# EAGLE design nixie-clock (EAGLE 9.2.2)
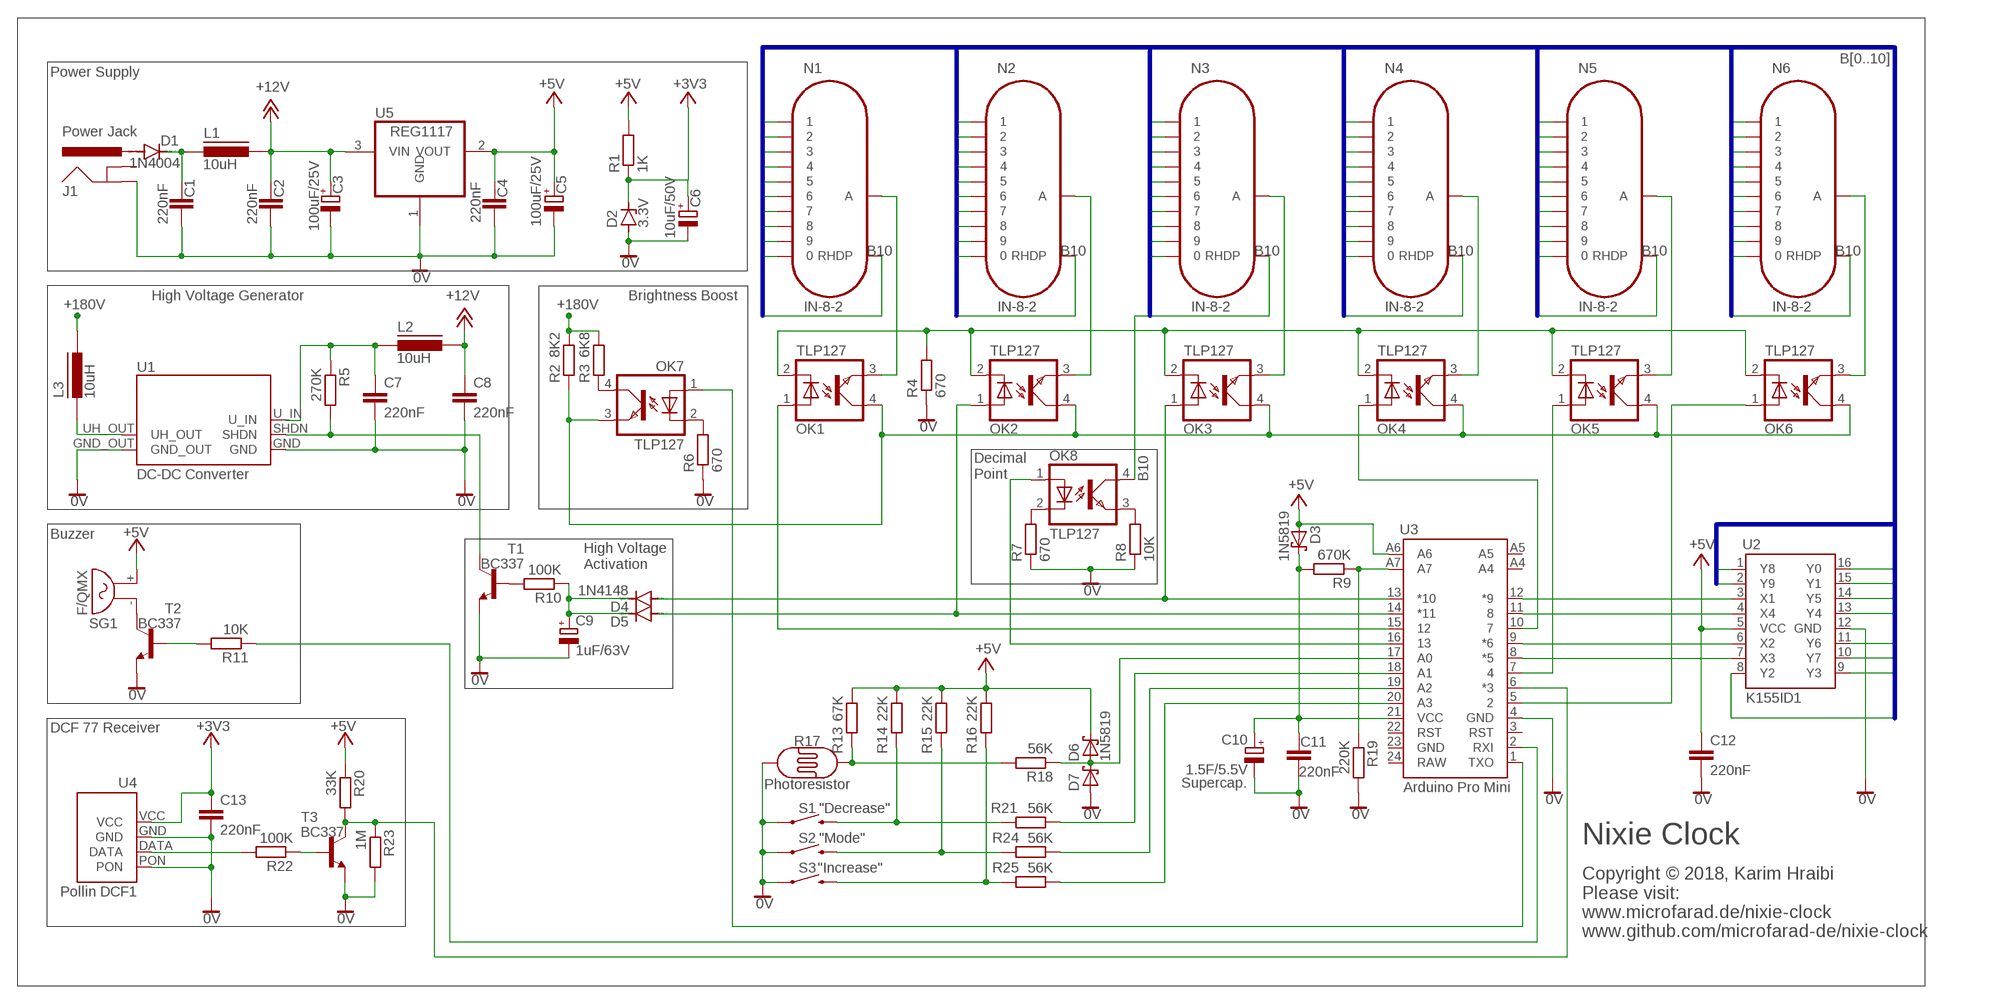
[diagram p0: schematic, sheet 1]

## Parts
C1  220nF  C-EU025-024X044  [C025-024X044]
C2  220nF  C-EU025-024X044  [C025-024X044]
C3  100uF/25V  CPOL-EUE2.5-6  [E2,5-6]
C4  220nF  C-EU025-024X044  [C025-024X044]
C5  100uF/25V  CPOL-EUE2.5-6  [E2,5-6]
C6  10uF/50V  CPOL-EUE2-4  [E2-4]
C7  220nF  C-EU025-024X044  [C025-024X044]
C8  220nF  C-EU025-024X044  [C025-024X044]
C9  1uF/63V  CPOL-EUE1.8-4  [E1,8-4]
C10  1.5F/5.5V  SUPERCAP/1.5F/5.5V  [SUPERCAP/1.5F/5.5V]
C11  220nF  C-EU025-024X044  [C025-024X044]
C12  220nF  C-EU025-024X044  [C025-024X044]
C13  220nF  C-EU025-024X044  [C025-024X044]
D1  1N4004  [DO41-10]
D2  3.3V  ZENER-DIODEZD-5  [ZDIO-5]
D3  1N5819  1N5819-B  [DO41-7.6]
D4  1N4148  1N4148DO35-7  [DO35-7]
D5  1N4148  1N4148DO35-7  [DO35-7]
D6  1N5819  1N5819-B  [DO41-7.6]
D7  1N5819  1N5819-B  [DO41-7.6]
J1  Power Jack  POWER_JACKSLT  [POWER_JACK_SLOT]
L1  10uH  CHOKE/9.5MM  [CHOKE/9.5MM]
L2  10uH  CHOKE/9.5MM  [CHOKE/9.5MM]
L3  10uH  CHOKE/9.5MM  [CHOKE/9.5MM]
N1  IN-8-2  [IN-8-2]
N2  IN-8-2  [IN-8-2]
N3  IN-8-2  [IN-8-2]
N4  IN-8-2  [IN-8-2]
N5  IN-8-2  [IN-8-2]
N6  IN-8-2  [IN-8-2]
OK1  TLP127  [MINI-FLAT-4]
OK2  TLP127  [MINI-FLAT-4]
OK3  TLP127  [MINI-FLAT-4]
OK4  TLP127  [MINI-FLAT-4]
OK5  TLP127  [MINI-FLAT-4]
OK6  TLP127  [MINI-FLAT-4]
OK7  TLP127  [MINI-FLAT-4]
OK8  TLP127  [MINI-FLAT-4]
R1  1K  R-EU_0207/7  [0207/7]
R2  8K2  R-EU_0207/7  [0207/7]
R3  6K8  R-EU_0207/7  [0207/7]
R4  670  R-EU_0207/7  [0207/7]
R5  270K  R-EU_0207/7  [0207/7]
R6  670  R-EU_0207/7  [0207/7]
R7  670  R-EU_0207/7  [0207/7]
R8  10K  R-EU_0207/7  [0207/7]
R9  670K  R-EU_0207/7  [0207/7]
R10  100K  R-EU_0207/7  [0207/7]
R11  10K  R-EU_0207/7  [0207/7]
R13  67K  R-EU_0207/7  [0207/7]
R14  22K  R-EU_0207/7  [0207/7]
R15  22K  R-EU_0207/7  [0207/7]
R16  22K  R-EU_0207/7  [0207/7]
R17  Photoresistor  PHOTOCELLPTH  [PHOTOCELL]
R18  56K  R-EU_0207/7  [0207/7]
R19  220K  R-EU_0207/7  [0207/7]
R20  33K  R-EU_0207/7  [0207/7]
R21  56K  R-EU_0207/7  [0207/7]
R22  100K  R-EU_0207/7  [0207/7]
R23  1M  R-EU_0207/7  [0207/7]
R24  56K  R-EU_0207/7  [0207/7]
R25  56K  R-EU_0207/7  [0207/7]
S1  "Decrease"  MOMENTARY-SWITCH-SPST-PTH-6.0MM  [TACTILE_SWITCH_PTH_6.0MM]
S2  "Mode"  MOMENTARY-SWITCH-SPST-PTH-6.0MM  [TACTILE_SWITCH_PTH_6.0MM]
S3  "Increase"  MOMENTARY-SWITCH-SPST-PTH-6.0MM  [TACTILE_SWITCH_PTH_6.0MM]
SG1  F/QMX  [F/QMX]
T1  BC337  [TO92]
T2  BC337  [TO92]
T3  BC337  [TO92]
U1  DC-DC Converter  CHINA_HV_DC_DC  [CHINA_HV_DC_DC]
U2  K155ID1  [DIL16]
U3  Arduino Pro Mini  ARDUINO_PRO_MINI_TS  [ARDUINO_PRO_MINI_TS]
U4  Pollin DCF1  DCF1  [DCF1]
U5  REG1117  [SOT223]

## Nets
0V: C1.2 C2.2 C3.- C4.2 C5.- C6.- C7.2 C8.2 C9.- C10.- C11.2 C12.2 C13.2 D2.A D7.A J1.GND@2(GND) R4.1 R6.1 R7.1 R8.1 R17.1 R19.2 R23.2 S1.1 S2.1 S3.1 T1.1(E) T2.1(E) T3.1(E) U1.GND U1.GND_OUT U2.12(GND) U3.4(GND) U4.GND U4.PON U5.1(GND)
180VRAW: L3.1 U1.UH_OUT
+3V3: C6.+ C13.1 D2.C R1.1 U4.VCC
+5V: C4.1 C5.+ C12.1 D3.A D6.C R1.2 R13.1 R14.1 R15.1 R16.1 R20.1 SG1.+ U2.5(VCC) U3.A6 U5.2(VOUT)
+12V: C2.1 C3.+ C8.1 L1.2 L2.2 U5.3(VIN)
+180V: L3.2 R2.2 R3.2
B0: N1.0 N2.0 N3.0 N4.0 N5.0 N6.0 U2.16(Y0)
B1: N1.1 N2.1 N3.1 N4.1 N5.1 N6.1 U2.15(Y1)
B2: N1.2 N2.2 N3.2 N4.2 N5.2 N6.2 U2.8(Y2)
B3: N1.3 N2.3 N3.3 N4.3 N5.3 N6.3 U2.9(Y3)
B4: N1.4 N2.4 N3.4 N4.4 N5.4 N6.4 U2.13(Y4)
B5: N1.5 N2.5 N3.5 N4.5 N5.5 N6.5 U2.14(Y5)
B6: N1.6 N2.6 N3.6 N4.6 N5.6 N6.6 U2.11(Y6)
B7: N1.7 N2.7 N3.7 N4.7 N5.7 N6.7 U2.10(Y7)
B8: N1.8 N2.8 N3.8 N4.8 N5.8 N6.8 U2.1(Y8)
B9: N1.9 N2.9 N3.9 N4.9 N5.9 N6.9 U2.2(Y9)
B10: N1..(RHDP) N2..(RHDP) N3..(RHDP) N4..(RHDP) N5..(RHDP) N6..(RHDP) OK8.4(COL)
N$1: N6.A OK6.3(EMIT)
N$2: N5.A OK5.3(EMIT)
N$3: N4.A OK4.3(EMIT)
N$4: N3.A OK3.3(EMIT)
N$5: N2.A OK2.3(EMIT)
N$6: N1.A OK1.3(EMIT)
N$7: OK1.4(COL) OK2.4(COL) OK3.4(COL) OK4.4(COL) OK5.4(COL) OK6.4(COL) OK7.3(EMIT) R2.1
N$8: OK7.4(COL) R3.1
N$9: OK6.1(A) U3.5
N$10: OK5.1(A) U3.7
N$11: OK4.1(A) U3.10
N$12: D4.A OK3.1(A) U3.13(*10)
N$13: D5.A OK2.1(A) U3.14(*11)
N$14: OK1.1(A) U3.15
N$15: C7.1 L2.1 R5.1 U1.U_IN
N$16: R10.2 T1.2(B)
N$17: C9.+ D4.C D5.C R10.1
N$18: R5.2 T1.3(C) U1.SHDN
N$19: OK1.2(C) OK2.2(C) OK3.2(C) OK4.2(C) OK5.2(C) OK6.2(C) R4.2
N$20: OK7.2(C) R6.2
N$21: OK7.1(A) U3.1(TXO)
N$22: OK8.3(EMIT) R8.2
N$23: OK8.2(C) R7.2
N$24: OK8.1(A) U3.16
N$25: D1.A J1.PWR
N$26: C1.1 D1.C L1.1
N$27: R20.2 R23.1 T3.3(C) U3.6(*3)
N$28: R11.2 T2.2(B)
N$29: R22.1 T3.2(B)
N$30: R22.2 U4.DATA
N$31: SG1.- T2.3(C)
N$32: R11.1 U3.2(RXI)
N$33: C10.+ C11.1 D3.C R9.2 U3.21(VCC)
N$34: R9.1 R19.1 U3.A7
N$35: D6.A D7.C R18.1 U3.17(A0)
N$36: R13.2 R17.2 R18.2
N$37: R14.2 R21.2 S1.3
N$38: R15.2 R24.2 S2.3
N$39: R16.2 R25.2 S3.3
N$40: R21.1 U3.18(A1)
N$41: R24.1 U3.19(A2)
N$42: R25.1 U3.20(A3)
X1: U2.3(X1) U3.12(*9)
X2: U2.6(X2) U3.9(*6)
X3: U2.7(X3) U3.8(*5)
X4: U2.4(X4) U3.11
Unconnected: J1.GND@1(GNDBREAK) U3.3(RST) U3.22(RST) U3.A4 U3.A5

## Buses
B[0..10]

## Notes on the sheet
- Power Supply
- High Voltage Generator | Brightness Boost
- Decimal
  Point
- Buzzer
- High Voltage
  Activation
- DCF 77 Receiver
- Supercap.
- Nixie Clock
- Copyright © 2018, Karim Hraibi
  Please visit:
  www.microfarad.de/nixie-clock
  www.github.com/microfarad-de/nixie-clock

## Power pins joined to a net without a drawn wire
GND: U3.23(GND)
RAW: U3.24(RAW)

## Library data of the parts
C1 C2 C4 C7 C8 C11-C13 = rcl:C-EU: CAPACITOR, European symbol; SPICEPREFIX: C
C3 C5 C6 C9 = rcl:CPOL-EU: POLARIZED CAPACITOR, European symbol; SPICEPREFIX: C
C10 = karim:SUPERCAP/1.5F/5.5V: Super-Capacitor Ratings: 5.5F 1.5v
D1 = diode:1N4004: DIODE general purpose rectifier, 1 A
D2 = diode:ZENER-DIODE: Z-Diode
D3 D6 D7 = diode:1N581*: 1.0A SCHOTTKY BARRIER RECTIFIER Source: http://www.diodes.com/datasheets/ds23001.pdf
D4 D5 = diode:1N4148: DIODE high speed (Philips)
J1 = SparkFun-Connectors:POWER_JACK: Power Jack Connector This is the standard 5.5mm barrel jack for power. The PTH is the most common, proven, reliable, footprint. The Slot footprint only works if the mill layer is transmitted to the PCB fab house so be warned. Here are the connectors we sell at SparkFun: DC Barrel Power Jack/Connector <https://www.sparkfun.com/products/119> (PRT-00119) DC Barrel Power Jack/Connector (SMD) <https://www.sparkfun.com/products/12748> (PRT-12748) DC Barrel Jack Adapter - Breadboard Compatible <https://www.sparkfun.com/products/10811> (PRT-10811) It is used on this SparkFun product (and many, many others): SparkFun RedBoard - Programmed with Arduino <https://www.sparkfun.com/products/12757> (DEV-12757) Also, if you need a mating power supply or connector, please check these out: Wall Adapter Power Supply - 9VDC 650mA <https://www.sparkfun.com/products/298> (TOL-00298) DC Barrel Jack Adapter - Male <https://www.sparkfun.com/products/10287> (PRT-10287); PROD_ID: PRT-00119
L1-L3 = microfarad-de:CHOKE/9.5MM: Choke Self-Wound around a 9.5mm ferrite bead.
N1-N6 = russian-nixies:IN-8-2: IN-8-2: medium numeric frontview nixie tube
OK1-OK8 = karim:TLP127: TOSHIBA PHOTOCOUPLER GaAs IRED & PHOTO-TRANSISTOR Source: http://www.semicon.toshiba.co.jp/td/en/Opto/Photocoupler/en_20050928_TLP283_datasheet.pdf; OC_FARNELL: unknown; OC_NEWARK: unknown
R1-R11 R13-R16 R18-R25 = rcl:R-EU_: RESISTOR, European symbol; SPICEPREFIX: R
R17 = SparkFun-Sensors:PHOTOCELL: Photocell (Photodetector, Photo Resistor, CdS) This is a very small light sensor. A photocell changes (also called a photodetector, photo resistor, CdS or photoconductive cell) resistance depending on the amount of light it is exposed to. These little sensors make great ambient light triggers (when light in the room turns on, do something). Datasheet <http://cdn.sparkfun.com/datasheets/Sensors/LightImaging/SEN-09088.pdf> SparkFun Products Mini Photocell <https://www.sparkfun.com/products/9088> (SEN-09088); PROD_ID: COMP-09129; SF_ID: SEN-09088
S1-S3 = SparkFun-Switches:MOMENTARY-SWITCH-SPST: Momentary Switch (Pushbutton) - SPST Normally-open (NO) SPST momentary switches (buttons, pushbuttons). Variants PTH-12MM - 12mm square, through-hole Momentary Pushbutton Switch - 12mm Square <https://www.sparkfun.com/products/9190> (COM-09190) PTH-6.0MM, PTH-6.0MM-KIT - 6.0mm square, through-hole Mini Pushbutton Switch <https://www.sparkfun.com/products/97> (COM-00097) KIT package intended for soldering kit's - only one side of pads' copper is exposed. PTH-RIGHT-ANGLE-KIT - Right-angle, through-hole Right Angle Tactile Button <https://www.sparkfun.com/products/10791> - Used on SparkFun BigTime Watch Kit <https://www.sparkfun.com/products/11734> SMD-12MM - 12mm square, surface-mount Tactile Button - SMD (12mm) <https://www.sparkfun.com/products/12993> (COM-12993) Used on SparkFun PicoBoard <https://www.sparkfun.com/products/11888> SMD-4.5MM - 4.5mm Square Trackball Switch Used on SparkFun Blackberry Trackballer Breakout <https://www.sparkfun.com/products/13169> SMD-4.6MMX2.8MM - 4.60mm x 2.80mm, surface mount Used on SparkFun SAMD21 Mini Breakout <https://www.sparkfun.com/products/13664> SMD-5.2MM, SMD-5.2-REDUNDANT - 5.2mm square, surface-mount Mini Pushbutton Switch - SMD <https://www.sparkfun.com/products/8720> (COM-08720) Used on Arduino Pro Mini <https://www.sparkfun.com/products/11114> REDUNDANT package connects both switch circuits together SMD-6.0X3.5MM - 6.0 x 3.5mm, surface mount Momentary Reset Switch SMD <https://www.sparkfun.com/products/8229> (COM-08229) SMD-6.2MM-TALL - 6.2mm square, surface mount Tactile Button - SMD (6mm) <https://www.sparkfun.com/products/12992> Used on SparkFun Digital Sandbox <https://www.sparkfun.com/products/12651> SMD-RIGHT-ANGLE - Right-angle, surface mount Used on SparkFun Block for Intel® Edison - Arduino <https://www.sparkfun.com/products/13036>; PROD_ID: SWCH-08441; SF_SKU: COM-00097
SG1 = buzzer:F/QMX: BUZZER Source: Buerklin; OC_FARNELL: unknown; OC_NEWARK: unknown
T1-T3 = transistor:BC337: NPN TRANSISTOR
U1 = karim:CHINA_HV_DC_DC: High-Voltage DC-DC Converter From no-name Chinese manufacturer. Specifications: Designation: "WAGO 250-3.5" Input voltage: 12v - 24v Output voltage: 85v - 235v
U2 = karim:K155ID1: K155ID1 A BCD-to-decimal decoder designed to drive gas-filled Nixie tubes
U3 = karim:ARDUINO_PRO_MINI: Arduino Pro Mini Arduino Pro Mini compatible devices. Variants: Original "The Simple" clone (TS)
U4 = karim:DCF1: Pollin DCF1 DCF77 time signal receiver. Specifications Power supply: 1.2v - 3.3v Current: <90uA - 100uA
U5 = burr-brown:REG1117: 800mA and 1A Low Dropout (LDO) Positive Regulator 1.8V, 2.5V, 2.85V, 3.3V, 5V, and Adj; MPN: REG1117; OC_FARNELL: 1097566; OC_NEWARK: 14P6981

## Board
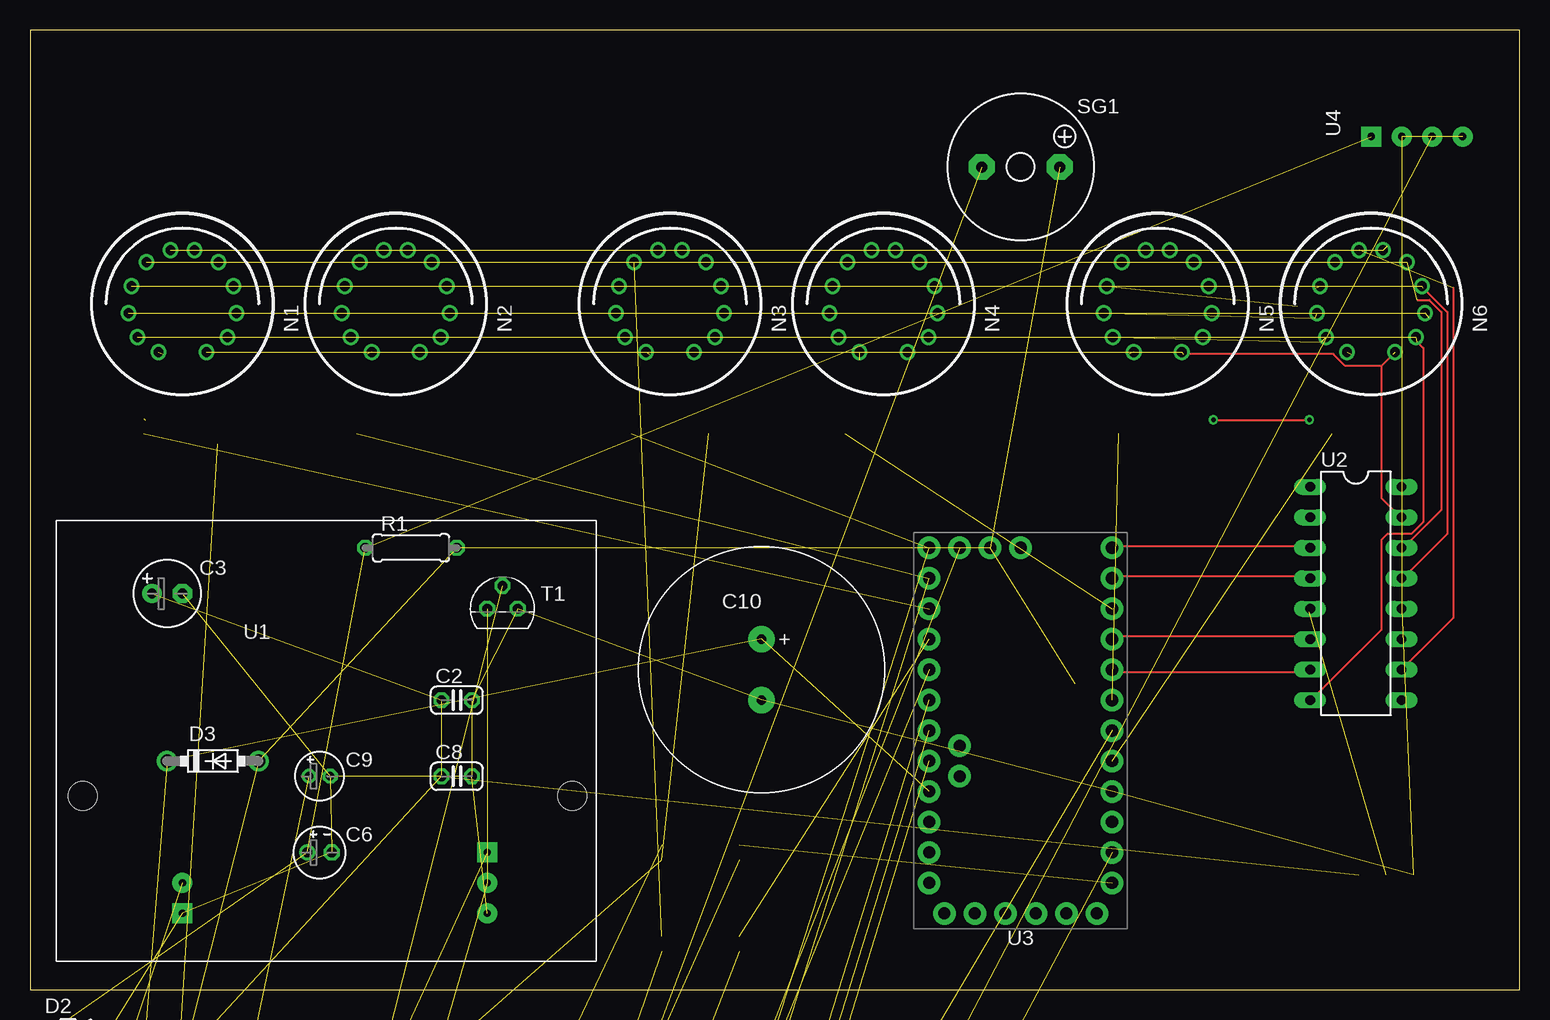
[diagram p1: board, top side]
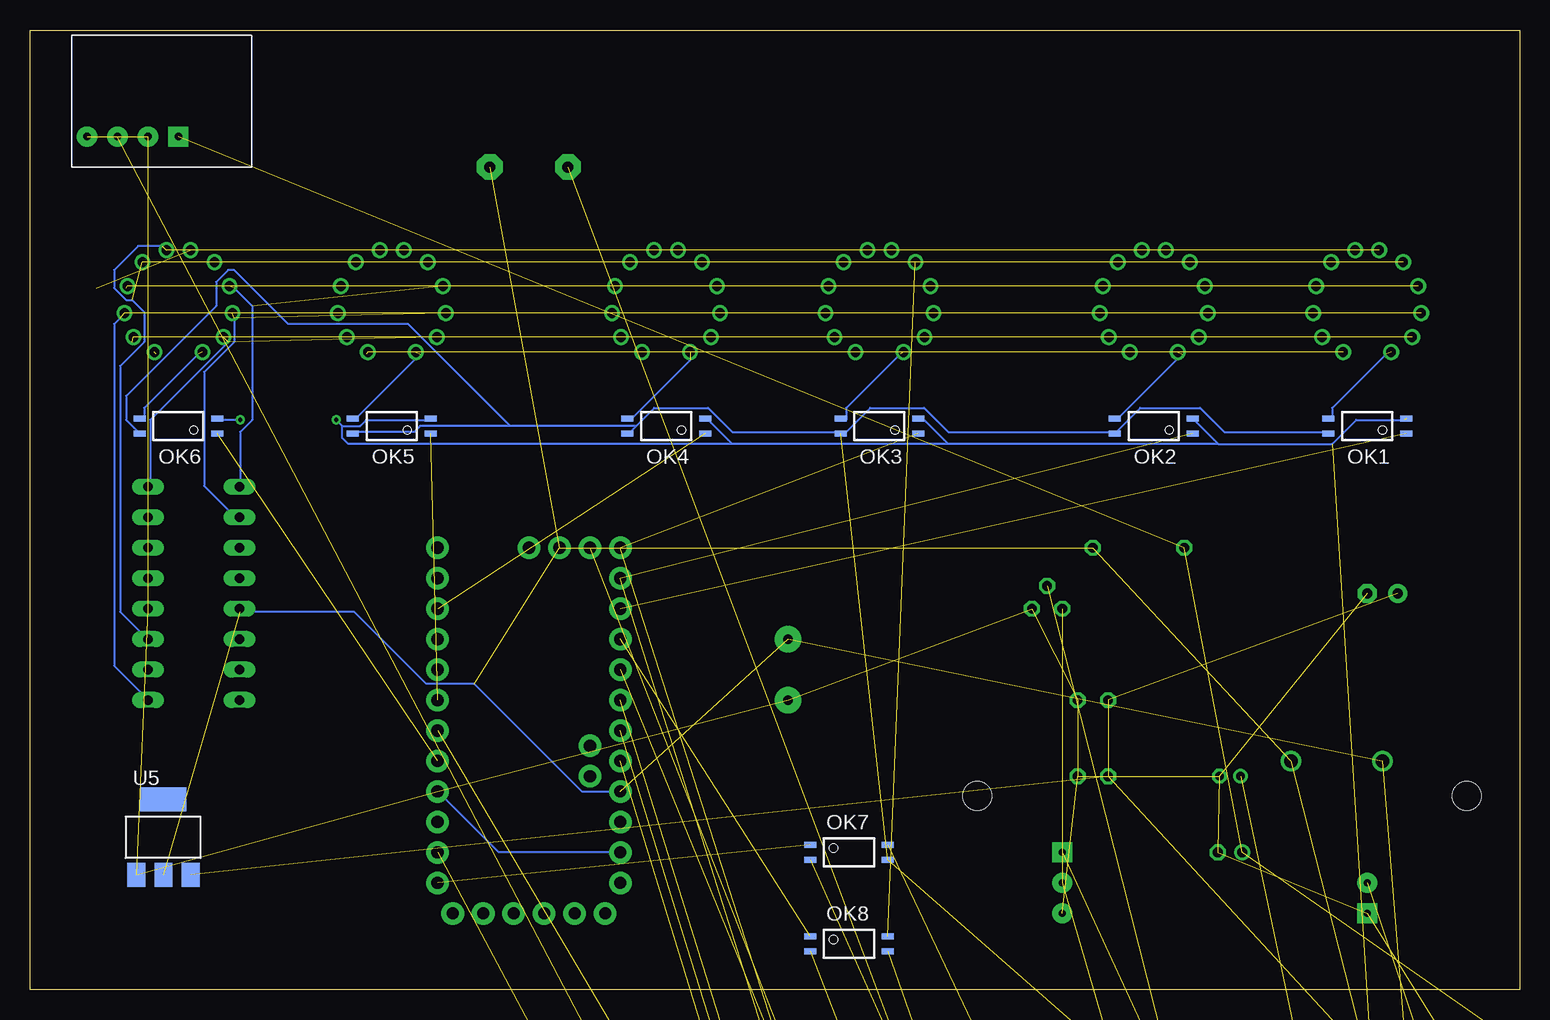
[diagram p2: board, bottom side, seen from below]

Size 124.13 x 80 mm. Coordinates in mm from the lower left corner, seen from the top.
Outline: 0,0 124.13,0 124.13,80 0,80 0,0
Copper layers (1*16): Top 0.035mm / dielectric 1.5mm / Bottom 0.035mm
Design rules "default": minimum track width 6mil, minimum drill 0.35mm, track to track 6mil, track to pad 6mil, pad to pad 6mil, via to via 6mil, smd to smd 6mil, copper to edge 40mil, drill to drill 6mil, minimum pad ring 10mil, minimum via ring 8mil, stop-mask expansion 4mil, vias tented up to drill 0mil, thermal gap 10mil

### Footprints (pad centres in the part's own frame; a part is rotated, then mirrored left to right if it is on the bottom)
C025-024X044 = drill 0.813 octagon: 1 -1.27,0; 2 1.27,0
E2,5-6 = drill 0.813 pad 1.6: + -1.27,0 | drill 0.813 pad 1.6 octagon: - 1.27,0
E2-4 = drill 0.813 pad 1.27: + -1.016,0 | drill 0.813 pad 1.27 octagon: - 1.016,0
E1,8-4 = drill 0.711 pad 1.168: + -0.889,0 | drill 0.711 pad 1.168 octagon: - 0.889,0
SUPERCAP/1.5F/5.5V = drill 0.8 pad 2.184: + 0,2.54; - 0,-2.54
DO41-10 = drill 1.118: A 5.08,0; C -5.08,0
ZDIO-5 = drill 0.813 octagon: A 2.54,0; C -2.54,0
DO41-7.6 = drill 1.1 pad 1.7: A 3.81,0; C -3.81,0
DO35-7 = drill 0.813 long: A 3.81,0; C -3.81,0
POWER_JACK_SLOT = drill 1 pad 2 long: GND@1 2.58,7.5; GND@2 7.58,10.8; PWR 2.58,13.8
CHOKE/9.5MM = drill 0.6 pad 1.676: 1 -5.08,0; 2 -1.27,0
IN-8-2 = drill 0.8: 0 -3.75,-2.75; 1 2,-4; 2 3.75,-2.75; 3 4.5,-0.75; 4 4.25,1.5; 5 3,3.5; 6 1,4.5; 7 -1,4.5; 8 -4.25,1.5; 9 -4.5,-0.75; . -3,3.5; A -2,-4
MINI-FLAT-4 = smd 1 x 0.5: 1 -3.24,0.635; 2 -3.24,-0.635; 3 3.24,-0.635; 4 3.24,0.635
0207/7 = drill 0.813 octagon: 1 -3.81,0; 2 3.81,0
PHOTOCELL = drill 0.8 pad 1.676: 1 -2,0; 2 2,0
TACTILE_SWITCH_PTH_6.0MM = drill 1.016 pad 1.88: 1 -3.251,2.261; 2 3.251,2.261; 3 -3.251,-2.261; 4 3.251,-2.261
F/QMX = drill 0.914 pad 2.159 octagon: + 3.251,0; - -3.251,0
TO92 = drill 0.813 octagon: 1 1.27,0; 2 0,1.905; 3 -1.27,0
CHINA_HV_DC_DC = drill 0.6 pad 1.676: GND 13.97,-12.7; SHDN 13.97,-10.16; UH_OUT -11.43,-10.16 | drill 0.6 pad 1.676 square: GND_OUT -11.43,-12.7; U_IN 13.97,-7.62 | hole 2.4: 21.07,-2.9; -19.73,-2.9
DIL16 = drill 0.813 long: 1 -3.81,8.89; 2 -3.81,6.35; 3 -3.81,3.81; 4 -3.81,1.27; 5 -3.81,-1.27; 6 -3.81,-3.81; 7 -3.81,-6.35; 8 -3.81,-8.89; 9 3.81,-8.89; 10 3.81,-6.35; 11 3.81,-3.81; 12 3.81,-1.27; 13 3.81,1.27; 14 3.81,3.81; 15 3.81,6.35; 16 3.81,8.89
ARDUINO_PRO_MINI_TS = drill 1.016 pad 1.88: 1 -7.62,12.7; 2 -7.62,10.16; 3 -7.62,7.62; 4 -7.62,5.08; 5 -7.62,2.54; 6 -7.62,0; 7 -7.62,-2.54; 8 -7.62,-5.08; 9 -7.62,-7.62; 10 -7.62,-10.16; 11 -7.62,-12.7; 12 -7.62,-15.24; 13 7.62,-15.24; 14 7.62,-12.7; 15 7.62,-10.16; 16 7.62,-7.62; 17 7.62,-5.08; 18 7.62,-2.54; 19 7.62,0; 20 7.62,2.54; 21 7.62,5.08; 22 7.62,7.62; 23 7.62,10.16; 24 7.62,12.7; A4 5.08,1.27; A5 5.08,3.81; A6 2.54,-15.24; A7 5.08,-15.24; BLK 6.35,15.24; DTR -6.35,15.24; GND 3.81,15.24; GND2 0,-15.24; RXI -1.27,15.24; TXO -3.81,15.24; VCC 1.27,15.24
DCF1 = drill 0.6 pad 1.676: DATA -2.54,-2.54; GND -2.54,0; PON -2.54,-5.08 | drill 0.6 pad 1.676 square: VCC -2.54,2.54
SOT223 = smd 1.499 x 2.007: 1 -2.261,-3.15; 2 0.025,-3.15; 3 2.311,-3.15 | smd 3.81 x 2.007: 4 0,3.15

### Placement (x,y rotation side)
C1  -20.32,-262.89 0 top  (outside the outline)
C2  35.56,24.13 0 top
C3  11.43,33.02 0 top
C4  2.54,-53.34 0 top  (outside the outline)
C5  3.81,-45.72 0 top  (outside the outline)
C6  24.13,11.43 0 top
C7  -20.32,-270.51 0 top  (outside the outline)
C8  35.56,17.78 0 top
C9  24.13,17.78 0 top
C10  60.96,26.67 0 top
C11  2.54,-106.68 0 top  (outside the outline)
C12  2.54,-114.3 0 top  (outside the outline)
C13  -8.89,-139.7 0 top  (outside the outline)
D1  -5.08,-132.08 0 top  (outside the outline)
D2  3.81,-3.81 0 top  (outside the outline)
D3  15.24,19.05 0 top
D4  -17.78,-241.3 0 top  (outside the outline)
D5  -17.78,-247.65 0 top  (outside the outline)
D6  -17.78,-278.13 0 top  (outside the outline)
D7  -17.78,-300.99 0 top  (outside the outline)
J1  -10.16,-127 0 top  (outside the outline)
L1  6.35,-13.97 0 top  (outside the outline)
L2  6.35,-68.58 0 top  (outside the outline)
L3  6.35,-25.4 0 top  (outside the outline)
N1  12.7,57.15 0 top
N2  30.48,57.15 0 top
N3  53.34,57.15 0 top
N4  71.12,57.15 0 top
N5  93.98,57.15 0 top
N6  111.76,57.15 0 top
OK1  12.7,46.99 180 bottom
OK2  30.48,46.99 180 bottom
OK3  53.34,46.99 180 bottom
OK4  71.12,46.99 180 bottom
OK5  93.98,46.99 180 bottom
OK6  111.76,46.99 180 bottom
OK7  55.88,11.43 0 bottom
OK8  55.88,3.81 0 bottom
R1  31.75,36.83 0 top
R2  5.08,-34.29 0 top  (outside the outline)
R3  6K7  [0207/7]  5.08,-96.52 0 top  (outside the outline)
R4  5.08,-60.96 0 top  (outside the outline)
R5  5.08,-91.44 0 top  (outside the outline)
R6  5.08,-101.6 0 top  (outside the outline)
R7  5.08,-127 0 top  (outside the outline)
R8  5.08,-121.92 0 top  (outside the outline)
R9  -6.35,-186.69 0 top  (outside the outline)
R10  5.08,-86.36 0 top  (outside the outline)
R11  -6.35,-176.53 0 top  (outside the outline)
R13  -17.78,-220.98 0 top  (outside the outline)
R14  -17.78,-226.06 0 top  (outside the outline)
R15  -17.78,-231.14 0 top  (outside the outline)
R16  -17.78,-236.22 0 top  (outside the outline)
R17  -20.32,-198.12 0 top  (outside the outline)
R18  -6.35,-181.61 0 top  (outside the outline)
R19  -6.35,-191.77 0 top  (outside the outline)
R20  -6.35,-151.13 0 top  (outside the outline)
R21  -17.78,-285.75 0 top  (outside the outline)
R22  -6.35,-156.21 0 top  (outside the outline)
R23  -6.35,-161.29 0 top  (outside the outline)
R24  -17.78,-290.83 0 top  (outside the outline)
R25  -17.78,-295.91 0 top  (outside the outline)
S1  -12.7,-198.12 0 top  (outside the outline)
S2  -19.05,-205.74 0 top  (outside the outline)
S3  -19.05,-213.36 0 top  (outside the outline)
SG1  82.55,68.58 0 top
T1  39.37,31.75 0 top
T2  -7.62,-166.37 0 top  (outside the outline)
T3  -7.62,-146.05 0 top  (outside the outline)
U1  24.13,19.05 0 top
U2  110.49,33.02 0 top
U3  82.55,21.59 180 top
U4  114.3,73.66 90 top
U5  113.03,12.7 0 bottom

### Tracks (layer width: path | path; a pad name or v marks a point on that pad's centre or on a via)
0V  (35 unrouted)
180VRAW  (1 unrouted)
+3V3  (4 unrouted)
+5V  (14 unrouted)
  Bottom 0.152: 75.12,16.5 78.12,16.5 87.12,25.5 91.12,25.5 97.12,31.5 106.62,31.5 U2.5
+12V  (5 unrouted)
+180V  (2 unrouted)
B0  (6 unrouted)
  Bottom 0.152: 107.62,54 114.12,47.5 114.12,42 U2.16
B1  (6 unrouted)
  Top 0.152: 96.12,53 108.62,53 109.62,52 112.62,52 | 113.62,53 112.62,52 | 112.62,52 112.62,41 114.12,39.5 U2.15
B2  (6 unrouted)
  Top 0.152: 115.62,54 116.12,53.5 116.12,39 115.12,38 113.12,38 112.62,37.5 112.62,30 107.12,24.5 U2.8
B3  (6 unrouted)
  Bottom 0.152: 116.62,56 117.12,55.5 117.12,27 114.62,24.5 U2.9
B4  (6 unrouted)
  Top 0.152: 116.12,58.5 118.12,56.5 118.12,38 114.62,34.5 U2.13
B5  (6 unrouted)
  Top 0.152: 115.62,57.5 116.62,57.5 117.62,56.5 117.62,40 114.62,37 U2.14
B6  (6 unrouted)
  Bottom 0.152: 113.12,62 115.12,62 117.12,60 117.12,58.5 116.12,57.5 115.62,57.5 114.62,56.5 114.62,54 116.62,52 116.62,31.5 114.62,29.5 U2.11
B7  (6 unrouted)
  Top 0.152: 118.62,58.5 118.62,31 114.62,27 U2.10
B8  (6 unrouted)
  Bottom 0.152: 107.12,58.5 105.62,57 105.62,47.5 106.62,46.5 106.62,42 U2.1
B9  (6 unrouted)
  Bottom 0.152: 107.12,56 107.12,54 109.62,51.5 109.62,42 107.12,39.5 U2.2
B10  (6 unrouted)
GND
  Bottom 0.152: 90.12,16.5 85.12,11.5 75.12,11.5 U3.23
N$1  (1 unrouted)
  Bottom 0.152: 110.12,53 114.62,48.5 114.62,47.5 OK6.3
N$2  (1 unrouted)
  Bottom 0.152: 91.62,53 97.12,47.5 OK5.3
N$3  (1 unrouted)
  Bottom 0.152: 69.12,52.5 74.12,47.5 OK4.3
N$4  (1 unrouted)
  Bottom 0.152: 51.62,53 56.12,48.5 56.12,47.5 OK3.3
N$5  (1 unrouted)
  Bottom 0.152: 28.12,53 33.62,47.5 OK2.3
N$6  (1 unrouted)
  Bottom 0.152: 11.12,53 15.62,48.5 15.62,47.5 OK1.3
N$7  (2 unrouted)
  Bottom 0.152: OK1.4 16.12,46.5 24.62,46.5 26.62,48.5 31.62,48.5 33.62,46.5 OK2.4 34.12,46.5 47.62,46.5 49.62,48.5 54.12,48.5 56.12,46.5 OK3.4 56.62,46.5 65.62,46.5 67.62,48.5 72.12,48.5 73.62,47 | 73.62,47 74.12,46.5 OK4.4 | 73.62,47 84.12,47 | 84.12,47 91.62,47 92.12,46.5 97.12,46.5 OK5.4 | 84.12,47 92.62,55.5 102.62,55.5 107.12,60 107.62,60 108.62,59 108.62,57 116.12,49.5 116.12,47.5 115.12,46.5 OK6.4
N$8  (1 unrouted)
N$9  (1 unrouted)
N$10  (1 unrouted)
N$11  (1 unrouted)
N$12  (2 unrouted)
N$13  (2 unrouted)
N$14  (1 unrouted)
N$15  (3 unrouted)
N$16  (1 unrouted)
N$17  (3 unrouted)
N$18  (2 unrouted)
N$19  (via drill 0.35)  (2 unrouted)
  Top 0.152: v98.62,47.5 v106.62,47.5
  Bottom 0.152: 9.62,47.5 13.62,47.5 15.62,45.5 25.12,45.5 | 25.12,45.5 27.12,47.5 OK2.2 | 47.62,45.5 49.62,47.5 OK3.2 | 25.12,45.5 47.62,45.5 | 65.62,45.5 67.62,47.5 OK4.2 | 47.62,45.5 65.62,45.5 | 98.12,47 96.62,47 96.12,47.5 91.12,47.5 OK5.2 | 98.12,47 98.12,46 97.62,45.5 65.62,45.5 | v106.62,47.5 108.12,47.5 OK6.2 | 98.12,47 v98.62,47.5
N$20  (1 unrouted)
N$21  (1 unrouted)
N$22  (1 unrouted)
N$23  (1 unrouted)
N$24  (1 unrouted)
N$25  (1 unrouted)
N$26  (2 unrouted)
N$27  (3 unrouted)
N$28  (1 unrouted)
N$29  (1 unrouted)
N$30  (1 unrouted)
N$31  (1 unrouted)
N$32  (1 unrouted)
N$33  (4 unrouted)
N$34  (2 unrouted)
N$35  (3 unrouted)
N$36  (2 unrouted)
N$37  (2 unrouted)
N$38  (2 unrouted)
N$39  (2 unrouted)
N$40  (1 unrouted)
N$41  (1 unrouted)
N$42  (1 unrouted)
X1
  Top 0.152: U2.3 106.62,37 90.62,37 U3.12
X2
  Top 0.152: U2.6 106.62,29.5 90.62,29.5 U3.9
X3
  Top 0.152: U2.7 106.62,26.5 90.62,26.5 U3.8
X4
  Top 0.152: U2.4 106.62,34.5 90.62,34.5 U3.11